# Altium schematic sheet Arduino_nano.SchDoc
size A4
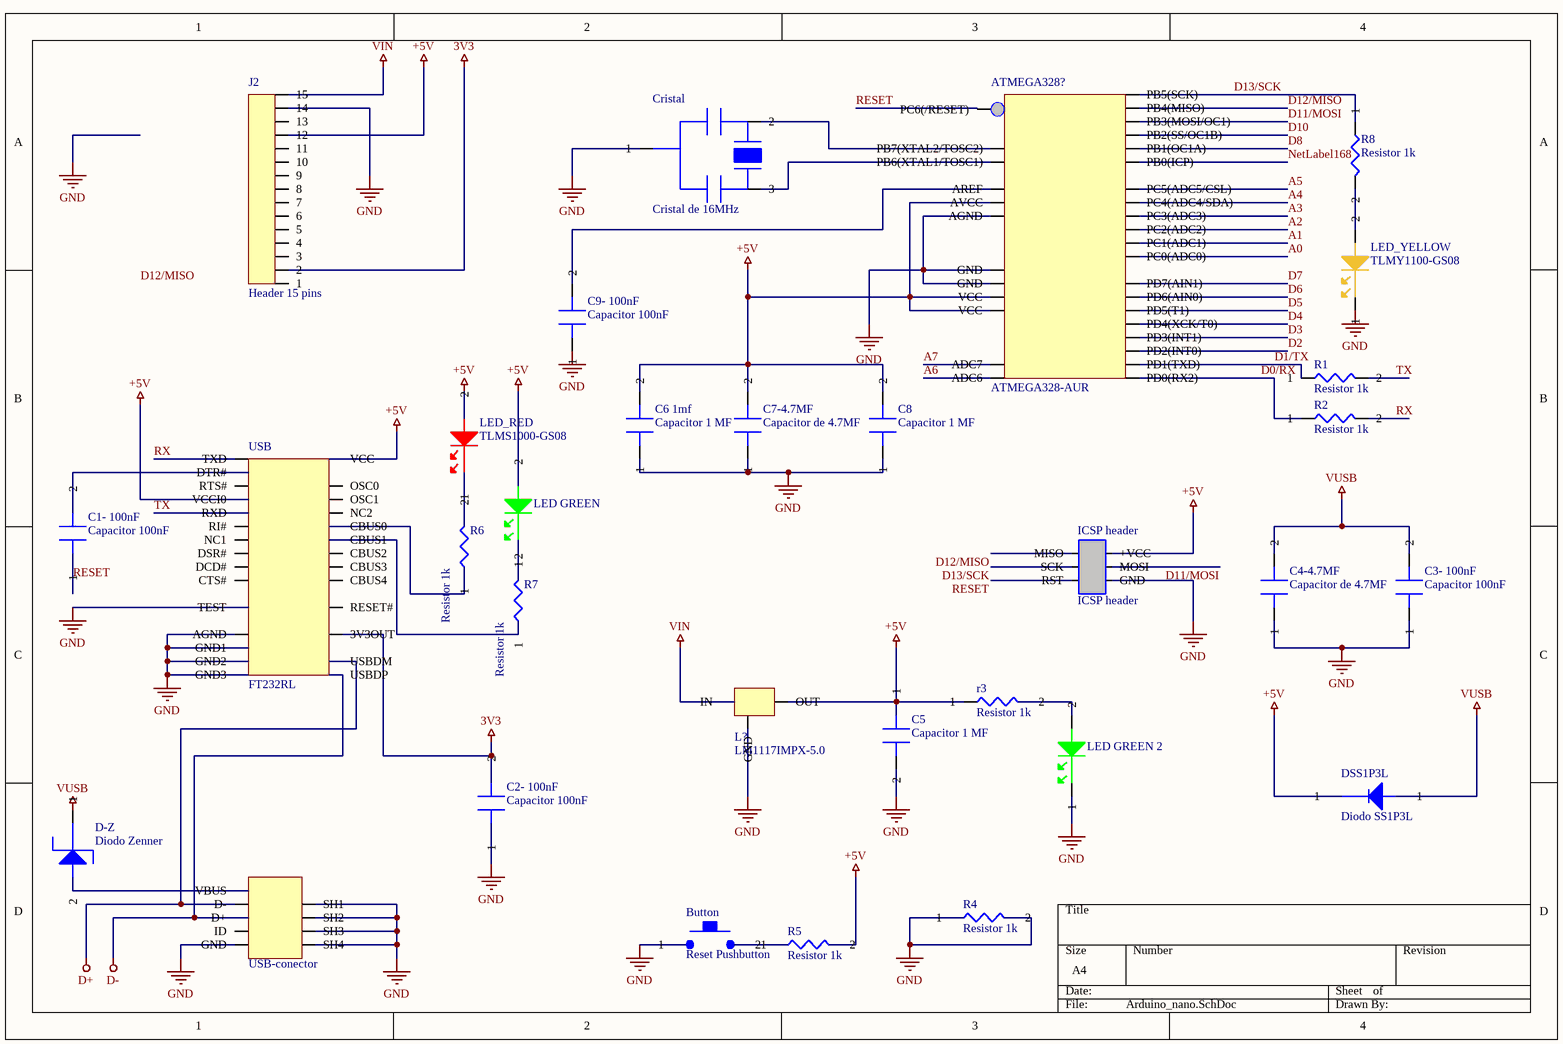
[diagram p0: Arduino_nano.SchDoc]

## Parts
(Parts that share a designator on the sheet are numbered #1, #2 ... from top to bottom, then left to right.)
ATMEGA328?  ATMEGA328-AUR
Button  Reset Pushbutton
C1-_100nF  Capacitor 100nF
C2-_100nF  Capacitor 100nF
C3-_100nF  Capacitor 100nF
C4-4.7MF  Capacitor de 4.7MF
C5  Capacitor 1 MF
C6_1mf  Capacitor 1 MF
C7-4.7MF  Capacitor de 4.7MF
C8  Capacitor 1 MF
C9-_100nF  Capacitor 100nF
Cristal  Cristal de 16MHz
D-Z  Diodo Zenner
DSS1P3L  Diodo SS1P3L
GREEN_LED?#1  LED GREEN
GREEN_LED?#2  LED GREEN 2
ICSP_header  ICSP header
J2  Header 15 pins
L?  LM1117IMPX-5.0
LED_RED  TLMS1000-GS08
LED_YELLOW  TLMY1100-GS08
R1  Resistor 1k
R2  Resistor 1k
r3  Resistor 1k
R4  Resistor 1k
R5  Resistor 1k
R6  Resistor 1k
R7  Resistor 1k
R8  Resistor 1k
USB  FT232RL
USB-conector  54819-1572  (value not drawn)

## Nets
3V3: C2-_100nF.2
+5V: C5.1 DSS1P3L.1 GREEN_LED?#1.2 LED_RED.2 R5.2 USB.38(VCCI0) USB.40(VCC)
D+: USB.36(USBDM)
D-: USB.35(USBDP) USB-conector.3(D+)
GND: Button.1 C2-_100nF.1 R4.1 R4.2 USB.37(RTS#) USB.38(GND1) USB.39(TEST)
VIN: L?.1(IN)
VUSB: DSS1P3L.1
RESET: C1-_100nF.1
TX: USB.35(TXD)
NetButton_2: Button.2 R5.1
NetC1-_100nF_2: C1-_100nF.2 USB.36(DTR#)
NetD-Z_2: D-Z.2 USB-conector.5(VBUS)
NetGREEN_LED?#1_1: GREEN_LED?#1.1 R7.2
NetGREEN_LED?#2_2: GREEN_LED?#2.2 r3.2
NetLED_RED_1: LED_RED.1 R6.2
NetR6_1: R6.1 USB.35(CBUS0)
NetR7_1: R7.1 USB.38(CBUS1)

Not connected (* = marked no-connect by the designer): ATMEGA328? 1(PC6(/RESET)) 2(PB7(XTAL2/TOSC2)) 3(PB6(XTAL1/TOSC1)) 4(AREF) 5(AVCC) 6(AGND) 7(GND) 8(GND) 9(VCC) 10(VCC) 11(ADC7) 12(ADC6) 13(PB5(SCK)) 14(PB4(MISO)) 15(PB3(MOSI/OC1)) 16(PB2(SS/OC1B)) 17(PB1(OC1A)) 18(PB0(ICP)) 19(PC5(ADC5/CSL)) 20(PC4(ADC4/SDA)) 21(PC3(ADC3)) 22(PC2(ADC2)) 23(PC1(ADC1)) 24(PC0(ADC0)) 25(PD7(AIN1)) 26(PD6(AIN0)) 27(PD5(T1)) 28(PD4(XCK/T0)) 29(PD3(INT1)) 30(PD2(INT0)) 31(PD1(TXD)) 32(PD0(RX2)); C3-_100nF 1 2; C4-4.7MF 1 2; C5 2; C6_1mf 1 2; C7-4.7MF 1 2; C8 1 2; C9-_100nF 1 2; Cristal 1 2 3; D-Z 1; GREEN_LED?#2 1; ICSP_header 1(MISO) 2(+VCC) 3(SCK) 4(MOSI) 5 (RST) 6(GND); J2 1 2 3 4 5 6 7 8 9 10 11 12 13 14 15; L? 2(GND) 3(OUT); LED_YELLOW 1 2; R1 1 2; R2 1 2; r3 1; R8 1 2; USB 41(3V3OUT); USB-conector 1(GND) 2(ID) 4(D-) 6(SH1) 7(SH2) 8(SH3) 9(SH4)

## Notes on the sheet
- Labels drawn without touching a wire or pin: D12/MISO, GND, VUSB

## Library data of the parts
ATMEGA328? = ATMEGA328-AUR: ATMEL         ATMEGA328-AUR            8 Bit Microcontroller, Low Power High Performance, ATmega, 20 MHz, 32 KB, 2 KB, 32 Pins, TQFP; Manufacturer: Microchip / Atmel; Frequency: 20MHz; Interface: I2C,SPI,UART,USART,2-Wire; Number of I/Os: 23; Oscillator Type: Internal; Memory Type: FLASH; Memory Size: 32KB; Peripherals: Brown-out Detect/Reset,POR,PWM,WDT; Core Architecture: AVR; RAM Size: 2KB; Max Supply Voltage: 5.5V; Min Supply Voltage: 1.8V; Number of Timers/Counters: 3; Data Bus Width: 8b; Watchdog Timer: Yes; Supplier 1: RSComponents; Manufacturer Part Number: ATMEGA328-AUR; RoHS: Yes; Category: Microcontrollers; Stock 1: 1; Pricing 1: 5=2,25100, 25=1,94400, 100=1,87500 (USD); Mount: Surface Mount; Case/Package: A; Number of Pins: 32; Contact Plating: Tin,Matte; Min Operating Temperature: -40°C; Max Operating Temperature: 85°C; Packaging: Tape and Reel; Series: AVR® ATmega; Package Quantity: 2000; Number of Programmable I/O: 23; Max Frequency: 20MHz; RoHS Compliant: Yes; REACH SVHC: No SVHC; ComponentLink1URL: https://datasheet.ciiva.com/46450/1693866-46450302.pdf?src-supplier=Element14; ComponentLink1Description: https://datasheet.ciiva.com/46450/1693866-46450302.pdf?src-supplier=Element14; Supplier Part Number 1: 1773199
Button = PTS526SK15SMTR2LFS: Switch Tactile N.O. SPST Round Button Gull Wing 0.05A 12VDC 200000Cycles 2.55N SMD T/R; Manufacturer: ITT C&K; Supplier 1: Digi-Key; Manufacturer Part Number: PTS526SK15SMTR2LFS; RoHS: No; Category: Tactile Switches; Stock 1: 94291; Pricing 1: 1=0,11000, 10=0,10900, 25=0,10280, 100=0,09360, 250=0,08800, 500=0,08052, 1000=0,06741 (USD); Supplier Part Number 1: CKN12221-1-ND
C1-_100nF C2-_100nF C3-_100nF C9-_100nF = CL21B104KBFXPJE: Ceramic Capacitor 0.1uF 10% X7R 50V 0805 Emboss T/R Automotive; Manufacturer: Samsung; Supplier 1: Digi-Key; Manufacturer Part Number: CL21B104KBFXPJE; RoHS: Yes; Category: Ceramic Capacitors; Stock 1: 128; Pricing 1: 1=0,24000, 10=0,16700, 50=0,11120, 100=0,09460, 500=0,06676, 1000=0,05842 (USD); RoHS Compliant: Yes; Supplier Part Number 1: 1276-CL21B104KBFXPJECT-ND
C4-4.7MF C7-4.7MF = M3253507E2A105KRMB: Manufacturer: KEMET; Supplier 1: Digi-Key; Manufacturer Part Number: M3253507E2A105KRMB; RoHS: No; Category: Ceramic Capacitors; Stock 1: 301; Pricing 1: 1=14,74000, 10=14,00300, 50=11,79200, 100=11,05500, 500=9,80210 (USD); RoHS Compliant: No; Supplier Part Number 1: 1001-2523-1-ND
C5 C6_1mf C8 = C1608X8L1C105K080AC: CAP CER 1UF 16V X8L 0603; Manufacturer: TDK; Tolerance: 10%; Supplier 1: Digi-Key; Manufacturer Part Number: C1608X8L1C105K080AC; RoHS: Yes; Category: Ceramic Capacitors; Stock 1: 20100; Pricing 1: 1=0,33000, 10=0,23000, 50=0,16100, 100=0,13800, 500=0,10350, 1000=0,08740 (USD); Mount: Surface Mount; Case/Package: 0603; Case Code (Imperial): 0603; Case Code (Metric): 1608; Min Operating Temperature: -55°C; Max Operating Temperature: 150°C; Features: High Temperature; Packaging: Tape and Reel; Capacitance: 1uF; Voltage Rating: 16V; ComponentLink1URL: https://product.tdk.com/info/en/documents/chara_sheet/C1608X8L1C105K080AC.pdf?src-supplier=Digi-Key; ComponentLink1Description: https://product.tdk.com/info/en/documents/chara_sheet/C1608X8L1C105K080AC.pdf?src-supplier=Digi-Key; Supplier Part Number 1: 445-175407-1-ND
Cristal = O 16,0-JO32-B-1V3-1-T1-LF: Manufacturer: Jauch; Supplier 1: Digi-Key; Manufacturer Part Number: O 16,0-JO32-B-1V3-1-T1-LF; RoHS: No; Stock 1: 147; Pricing 1: 1=0,90000, 10=0,79700, 50=0,74500, 100=0,65840 (USD); Supplier Part Number 1: 1908-O160-JO32-B-1V3-1-T1-LFCT-ND
D-Z = BZX884B5V1L-HG3-08: Diode Zener Single 5.1V 2% 300mW 2-Pin DFN1006 T/R; Manufacturer: Vishay; Supplier 1: Digi-Key; Manufacturer Part Number: BZX884B5V1L-HG3-08; Stock 1: 10000; Pricing 1: 1=0,38000, 10=0,31500, 100=0,16680, 500=0,10972, 1000=0,07461, 2000=0,06730, 5000=0,05852 (USD); Supplier Part Number 1: 112-BZX884B5V1L-HG3-08CT-ND
DSS1P3L = SS1P3L-M3/84A: Diode Schottky 30V 1.5A 2-Pin SMP T/R; Manufacturer: Vishay Semiconductors; Max Surge Current: 50A; Forward Voltage: 480mV; Max Reverse Current: 200uA; Element Configuration: Single; Current: 1A; Supplier 1: Digi-Key; Manufacturer Part Number: SS1P3L-M3/84A; RoHS: Yes; Category: Rectifier Diodes; Stock 1: 5665; Pricing 1: 1=0,48000, 10=0,39200, 100=0,26720, 500=0,20038, 1000=0,15028 (USD); Mount: Surface Mount; Case/Package: DO-220AA; Number of Pins: 2; Contact Plating: Tin,Matte; Min Operating Temperature: -55°C; Max Operating Temperature: 150°C; Packaging: Tape and Reel; Forward Current: 1.5A; Package Quantity: 1; Average Rectified Current: 1.5A; Peak Non-Repetitive Surge Current: 50A; Max Repetitive Reverse Voltage (Vrrm): 30V; Max Forward Surge Current (Ifsm): 50A; Voltage: 30V; Max Reverse Voltage (DC): 30V; Series: eSMP®; Length: 3.61mm; Width: 2.18mm; Height: 1.15mm; Radiation Hardening: No; Lead Free: Lead Free; RoHS Compliant: Yes; ComponentLink1URL: https://datasheet.ciiva.com/16217/ss1p3l-16217789.pdf?src-supplier=Future+Electronics; ComponentLink1Description: https://datasheet.ciiva.com/16217/ss1p3l-16217789.pdf?src-supplier=Future+Electronics; ComponentLink2URL: https://datasheet.ciiva.com/25932/ss1p3l-25932252.pdf?src-supplier=Avnet+Europe; ComponentLink2Description: https://datasheet.ciiva.com/25932/ss1p3l-25932252.pdf?src-supplier=Avnet+Europe; Supplier Part Number 1: SS1P3L-M3/84AGICT-ND
GREEN_LED?#1 GREEN_LED?#2 = TLMG1100-GS08: Standard LEDs - SMD Green Non-Diffused; Manufacturer: Vishay Semiconductors; Viewing Angle: 160°; Lens Style: Rectangular,Diffused; Luminous Intensity: 35mcd; Forward Current: 20mA; Forward Voltage: 2.1V; Wavelength: 570nm; Power Rating: 90mW; Number of Elements: 1; Voltage Rating (DC): 3V; Reverse Voltage: 6V; Supplier 1: Digi-Key; Manufacturer Part Number: TLMG1100-GS08; RoHS: Yes; Category: LEDs; Stock 1: 166547; Pricing 1: 1=0,42000, 10=0,34400, 100=0,23400, 500=0,17554, 1000=0,13165 (USD); Mount: Surface Mount,PCB; Case/Package: 0603; Number of Pins: 2; Color: Green; Case Code (Metric): 1608; Case Code (Imperial): 0603; Contact Plating: Gold; Min Operating Temperature: -40°C; Max Operating Temperature: 100°C; Packaging: Tape and Reel; Package Quantity: 1; Illumination Color: Green; Dominant Wavelength: 570nm; Test Current: 20mA; Power Dissipation: 90mW; Max Power Dissipation: 90mW; Number of LEDs: 1; Series: -; Length: 1.6mm; Width: 0.8mm; Height: 0.65mm; Depth: 0.8mm; Radiation Hardening: No; REACH SVHC: Unknown; Lead Free: Lead Free; RoHS Compliant: Yes; ComponentLink1URL: https://datasheet.ciiva.com/11773/0900766b80ed1fab-11773829.pdf?src-supplier=RSComponents; ComponentLink1Description: https://datasheet.ciiva.com/11773/0900766b80ed1fab-11773829.pdf?src-supplier=RSComponents; ComponentLink2URL: https://datasheet.ciiva.com/15118/getdatasheetpartid-196748-15118054.pdf?src-supplier=Verical; ComponentLink2Description: https://datasheet.ciiva.com/15118/getdatasheetpartid-196748-15118054.pdf?src-supplier=Verical; ComponentLink3URL: https://datasheet.ciiva.com/2109/tlmb1100-2109919.pdf?src-supplier=Digi-Key; ComponentLink3Description: https://datasheet.ciiva.com/2109/tlmb1100-2109919.pdf?src-supplier=Digi-Key; ComponentLink4URL: https://datasheet.ciiva.com/2109/tlmb1100-2109920.pdf?src-supplier=Digi-Key; ComponentLink4Description: https://datasheet.ciiva.com/2109/tlmb1100-2109920.pdf?src-supplier=Digi-Key; ComponentLink5URL: https://datasheet.ciiva.com/2109/tlmb1100-2109921.pdf?src-supplier=Digi-Key; ComponentLink5Description: https://datasheet.ciiva.com/2109/tlmb1100-2109921.pdf?src-supplier=Digi-Key; ComponentLink6URL: https://datasheet.ciiva.com/3166/tlmb1100-3166505.pdf?src-supplier=Avnet; ComponentLink6Description: https://datasheet.ciiva.com/3166/tlmb1100-3166505.pdf?src-supplier=Avnet; ComponentLink7URL: https://datasheet.ciiva.com/3166/tlmb1100-3166935.pdf?src-supplier=Avnet; ComponentLink7Description: https://datasheet.ciiva.com/3166/tlmb1100-3166935.pdf?src-supplier=Avnet; ComponentLink8URL: https://datasheet.ciiva.com/5798/tlmb1100-5798250.pdf?src-supplier=Farnell; ComponentLink8Description: https://datasheet.ciiva.com/5798/tlmb1100-5798250.pdf?src-supplier=Farnell; ComponentLink9URL: https://datasheet.ciiva.com/5798/485053-5798326.pdf?src-supplier=Farnell; ComponentLink9Description: https://datasheet.ciiva.com/5798/485053-5798326.pdf?src-supplier=Farnell; ComponentLink10URL: https://datasheet.ciiva.com/16299/tlmb1100-16299239.pdf?src-supplier=Future+Electronics; ComponentLink10Description: https://datasheet.ciiva.com/16299/tlmb1100-16299239.pdf?src-supplier=Future+Electronics; ComponentLink11URL: https://datasheet.ciiva.com/22655/1911389-22655622.pdf?src-supplier=Element14; ComponentLink11Description: https://datasheet.ciiva.com/22655/1911389-22655622.pdf?src-supplier=Element14; ComponentLink12URL: https://datasheet.ciiva.com/22655/1911389-22655641.pdf?src-supplier=Element14; ComponentLink12Description: https://datasheet.ciiva.com/22655/1911389-22655641.pdf?src-supplier=Element14; ComponentLink13URL: https://datasheet.ciiva.com/8027/485053-8027918.pdf?src-supplier=Element14; ComponentLink13Description: https://datasheet.ciiva.com/8027/485053-8027918.pdf?src-supplier=Element14; Supplier Part Number 1: 751-1165-1-ND
ICSP_header = MIKROE-4283: Manufacturer: mikroElektronika; Supplier 1: Digi-Key; Manufacturer Part Number: MIKROE-4283; RoHS: No; Stock 1: 4; Pricing 1: 1=4,00000 (USD); Supplier Part Number 1: 1471-MIKROE-4283-ND
J2 = 61301511121: WURTH ELEKTRONIK - 61301511121 - Connecteur carte-à-carte, Vertical, 2.54 mm, 15 Contact(s), Embase, Série WR-PHD, Traversant; Manufacturer: Wurth Electronics; Number of Positions: 15; Gender: Male; Connector Type: Male Pin; Pitch: 0.1inch; Supplier 1: Digi-Key; Manufacturer Part Number: 61301511121; RoHS: Yes; Category: Headers and Wire Housings; Stock 1: 1127; Pricing 1: 1=0,82000, 10=0,69700, 25=0,58120, 50=0,48400, 100=0,44000, 500=0,40000 (USD); Mount: Through Hole; Contact Plating: Gold; Contact Material: Copper; Color: Black; Number of Rows: 1; Packaging: Bulk; Termination: Solder; Number of Contacts: 15; Contact Mating Length: 0.236inch; REACH SVHC: Unknown; RoHS Compliant: Yes; ComponentLink1URL: http://www.farnell.com/cad/1737268.pdf?src-supplier=Element14; ComponentLink1Description: http://www.farnell.com/cad/1737268.pdf?src-supplier=Element14; ComponentLink2URL: https://katalog.we-online.de/em/datasheet/6130xx11121.pdf?src-supplier=Digi-Key; ComponentLink2Description: https://katalog.we-online.de/em/datasheet/6130xx11121.pdf?src-supplier=Digi-Key; Supplier Part Number 1: 732-5326-ND
L? = LM1117IMPX-5.0: IC REG LINEAR 5V 800MA SOT223-4; Manufacturer: Texas Instruments; Dropout Voltage: 1.2V; Number of Outputs: 1; Max Input Voltage: 15V; Polarity: Positive; Quiescent Current: 15mA; Accuracy: 1%; Output Type: Fixed; Supplier 1: Newark; Manufacturer Part Number: LM1117IMPX-5.0; RoHS: No; Category: Voltage Regulators - Linear; Mount: Surface Mount; Case/Package: SOT-223; Number of Pins: 4; Min Operating Temperature: -40°C; Max Operating Temperature: 125°C; Package Quantity: 2000; Packaging: Tape and Reel; Max Output Current: 800mA; Output Voltage: 5V; Output Current: 800mA; Number of Regulators: 1; Min Current Limit: 800mA; Output Voltage Accuracy: 1%; Radiation Hardening: No; Lead Free: Contains Lead; ComponentLink1URL: https://datasheet.ciiva.com/14275/lm1117-n-14275238.pdf?src-supplier=Avnet; ComponentLink1Description: https://datasheet.ciiva.com/14275/lm1117-n-14275238.pdf?src-supplier=Avnet; Supplier Part Number 1: 74C3927
LED_RED = TLMS1000-GS08: LED RED 0603 SMD; Manufacturer: Vishay; Forward Voltage: 1.8V; Luminous Intensity: 4mcd; Wavelength: 636nm; Viewing Angle: 160°; Forward Current: 2mA; Power Rating: 40mW; Lens Style: Rectangular; Dominant Wavelength: 628nm; Number of Elements: 1; Reverse Voltage: 12V; Supplier 1: Digi-Key; Manufacturer Part Number: TLMS1000-GS08; RoHS: Yes; Category: LEDs; Stock 1: 60794; Pricing 1: 1=0,42000, 10=0,34400, 100=0,23410, 500=0,17562, 1000=0,13171 (USD); Mount: Surface Mount; Case/Package: 0603; Number of Pins: 2; Color: Red; Case Code (Metric): 1608; Case Code (Imperial): 0603; Min Operating Temperature: -40°C; Max Operating Temperature: 100°C; Packaging: Tape and Reel; Package Quantity: 3000; Illumination Color: Red; Test Current: 2mA; Max Power Dissipation: 40mW; Power Dissipation: 40mW; Number of LEDs: 1; Series: -; Length: 1.6mm; Width: 0.8mm; Height: 0.6mm; Depth: 0.8mm; Radiation Hardening: No; REACH SVHC: Unknown; Lead Free: Lead Free; RoHS Compliant: Yes; ComponentLink1URL: https://datasheet.ciiva.com/4267/tlmo1000-4267955.pdf?src-supplier=Arrow+Electronics; ComponentLink1Description: https://datasheet.ciiva.com/4267/tlmo1000-4267955.pdf?src-supplier=Arrow+Electronics; ComponentLink2URL: https://datasheet.ciiva.com/5798/1698881-5798337.pdf?src-supplier=Farnell; ComponentLink2Description: https://datasheet.ciiva.com/5798/1698881-5798337.pdf?src-supplier=Farnell; ComponentLink3URL: https://datasheet.ciiva.com/15117/getdatasheetpartid-107692-15117475.pdf?src-supplier=Verical; ComponentLink3Description: https://datasheet.ciiva.com/15117/getdatasheetpartid-107692-15117475.pdf?src-supplier=Verical; ComponentLink4URL: https://datasheet.ciiva.com/26215/tlmo1000-26215312.pdf?src-supplier=Avnet+Europe; ComponentLink4Description: https://datasheet.ciiva.com/26215/tlmo1000-26215312.pdf?src-supplier=Avnet+Europe; ComponentLink5URL: https://datasheet.ciiva.com/8027/485055-8027936.pdf?src-supplier=Element14; ComponentLink5Description: https://datasheet.ciiva.com/8027/485055-8027936.pdf?src-supplier=Element14; ComponentLink6URL: https://datasheet.ciiva.com/9323/tlmo1000-9323993.pdf?src-supplier=Avnet; ComponentLink6Description: https://datasheet.ciiva.com/9323/tlmo1000-9323993.pdf?src-supplier=Avnet; ComponentLink7URL: https://datasheet.ciiva.com/18614/tlmo1000-18614329.pdf?src-supplier=Digi-Key; ComponentLink7Description: https://datasheet.ciiva.com/18614/tlmo1000-18614329.pdf?src-supplier=Digi-Key; ComponentLink8URL: https://datasheet.ciiva.com/29562/tlmo1000-29562780.pdf?src-supplier=Digi-Key; ComponentLink8Description: https://datasheet.ciiva.com/29562/tlmo1000-29562780.pdf?src-supplier=Digi-Key; ComponentLink9URL: https://datasheet.ciiva.com/29562/tlmo1000-29562781.pdf?src-supplier=Digi-Key; ComponentLink9Description: https://datasheet.ciiva.com/29562/tlmo1000-29562781.pdf?src-supplier=Digi-Key; ComponentLink10URL: https://datasheet.ciiva.com/29562/tlmo1000-29562782.pdf?src-supplier=Digi-Key; ComponentLink10Description: https://datasheet.ciiva.com/29562/tlmo1000-29562782.pdf?src-supplier=Digi-Key; ComponentLink11URL: https://datasheet.ciiva.com/16379/tlmo1000-16379643.pdf?src-supplier=Future+Electronics; ComponentLink11Description: https://datasheet.ciiva.com/16379/tlmo1000-16379643.pdf?src-supplier=Future+Electronics; ComponentLink12URL: https://datasheet.ciiva.com/8027/1698881-8027932.pdf?src-supplier=Element14; ComponentLink12Description: https://datasheet.ciiva.com/8027/1698881-8027932.pdf?src-supplier=Element14; ComponentLink13URL: https://datasheet.ciiva.com/8027/1698881-8027934.pdf?src-supplier=Element14; ComponentLink13Description: https://datasheet.ciiva.com/8027/1698881-8027934.pdf?src-supplier=Element14; ComponentLink14URL: https://datasheet.ciiva.com/22655/1698881-22655643.pdf?src-supplier=Element14; ComponentLink14Description: https://datasheet.ciiva.com/22655/1698881-22655643.pdf?src-supplier=Element14; Supplier Part Number 1: TLMS1000-GS08CT-ND
LED_YELLOW = TLMY1100-GS08: VISHAY - TLMY1100-GS08 - LED, Yellow, SMD, 0603, 20 mA, 2.1 V, 587 nm; Manufacturer: Vishay Semiconductors; Wavelength: 595nm; Luminous Intensity: 80mcd; Viewing Angle: 160°; Forward Voltage: 2.1V; Forward Current: 20mA; Lens Style: Rectangular,Diffused; Power Rating: 90mW; Dominant Wavelength: 587nm; Number of Elements: 1; Voltage Rating (DC): 3V; Reverse Voltage: 6V; Supplier 1: Digi-Key; Manufacturer Part Number: TLMY1100-GS08; RoHS: Yes; Category: LEDs; Stock 1: 1729; Pricing 1: 1=0,42000, 10=0,34400, 100=0,23440, 500=0,17580, 1000=0,13184 (USD); Mount: Surface Mount; Case/Package: 0603; Number of Pins: 2; Color: Yellow; Case Code (Metric): 1608; Case Code (Imperial): 0603; Contact Plating: Gold; Min Operating Temperature: -40°C; Max Operating Temperature: 100°C; Packaging: Tape and Reel; Illumination Color: Yellow; Package Quantity: 3000; Test Current: 20mA; Power Dissipation: 90mW; Number of LEDs: 1; Max Power Dissipation: 90mW; Series: -; Length: 1.6mm; Width: 0.8mm; Height: 0.65mm; Depth: 0.8mm; Radiation Hardening: No; REACH SVHC: Unknown; Lead Free: Lead Free; RoHS Compliant: Yes; ComponentLink1URL: https://datasheet.ciiva.com/4266/tlmb1100-4266598.pdf?src-supplier=Arrow+Electronics; ComponentLink1Description: https://datasheet.ciiva.com/4266/tlmb1100-4266598.pdf?src-supplier=Arrow+Electronics; ComponentLink2URL: https://datasheet.ciiva.com/26928/getdatasheetpartid-246085-26928483.pdf?src-supplier=Verical; ComponentLink2Description: https://datasheet.ciiva.com/26928/getdatasheetpartid-246085-26928483.pdf?src-supplier=Verical; ComponentLink3URL: https://datasheet.ciiva.com/2109/tlmb1100-2109916.pdf?src-supplier=Digi-Key; ComponentLink3Description: https://datasheet.ciiva.com/2109/tlmb1100-2109916.pdf?src-supplier=Digi-Key; ComponentLink4URL: https://datasheet.ciiva.com/2109/tlmb1100-2109917.pdf?src-supplier=Digi-Key; ComponentLink4Description: https://datasheet.ciiva.com/2109/tlmb1100-2109917.pdf?src-supplier=Digi-Key; ComponentLink5URL: https://datasheet.ciiva.com/2109/tlmb1100-2109918.pdf?src-supplier=Digi-Key; ComponentLink5Description: https://datasheet.ciiva.com/2109/tlmb1100-2109918.pdf?src-supplier=Digi-Key; ComponentLink6URL: https://datasheet.ciiva.com/3166/tlmb1100-3166936.pdf?src-supplier=Avnet; ComponentLink6Description: https://datasheet.ciiva.com/3166/tlmb1100-3166936.pdf?src-supplier=Avnet; ComponentLink7URL: https://datasheet.ciiva.com/26322/tlmb1100-26322126.pdf?src-supplier=Element14; ComponentLink7Description: https://datasheet.ciiva.com/26322/tlmb1100-26322126.pdf?src-supplier=Element14; ComponentLink8URL: https://datasheet.ciiva.com/16501/tlmb1100-16501335.pdf?src-supplier=Future+Electronics; ComponentLink8Description: https://datasheet.ciiva.com/16501/tlmb1100-16501335.pdf?src-supplier=Future+Electronics; ComponentLink9URL: https://datasheet.ciiva.com/26156/tlmb1100-26156618.pdf?src-supplier=Avnet+Europe; ComponentLink9Description: https://datasheet.ciiva.com/26156/tlmb1100-26156618.pdf?src-supplier=Avnet+Europe; ComponentLink10URL: https://datasheet.ciiva.com/14657/tlmb1100-14657975.pdf?src-supplier=Element14; ComponentLink10Description: https://datasheet.ciiva.com/14657/tlmb1100-14657975.pdf?src-supplier=Element14; Supplier Part Number 1: 751-1186-1-ND
R1 R2 r3 R4-R8 = Y40621K00000Q0R: RES SMD 1K OHM 0.02% 0.3W 0805; Manufacturer: VPG Foil Resistors; Resistance: 1kR; Max Power Dissipation: 300mW; Temperature Coefficient: 2.5ppm/°C; Supplier 1: Digi-Key; Manufacturer Part Number: Y40621K00000Q0R; RoHS: Yes; Category: Chip SMD Resistors; Stock 1: 125; Pricing 1: 1=19,65000, 10=17,16400, 25=15,51000 (USD); Case/Package: 0805; Case Code (Metric): 2012; Case Code (Imperial): 0805; Min Operating Temperature: -55°C; Max Operating Temperature: 200°C; Package Quantity: 1; Tolerance: 0.02%; Packaging: Tape and Reel; Resistor Type: Metal Foil; Number of Terminations: 2; Features: Moisture Resistant; Series: FRSH; Length: 0.08inch; Width: 0.05inch; Height: 0.025inch; RoHS Compliant: Yes; ComponentLink1URL: https://datasheet.ciiva.com/2629/frsh-z-2629516.pdf?src-supplier=Digi-Key; ComponentLink1Description: https://datasheet.ciiva.com/2629/frsh-z-2629516.pdf?src-supplier=Digi-Key; ComponentLink2URL: https://datasheet.ciiva.com/2629/frsh-z-2629517.pdf?src-supplier=Digi-Key; ComponentLink2Description: https://datasheet.ciiva.com/2629/frsh-z-2629517.pdf?src-supplier=Digi-Key; ComponentLink3URL: https://datasheet.ciiva.com/2629/frsh-z-2629518.pdf?src-supplier=Digi-Key; ComponentLink3Description: https://datasheet.ciiva.com/2629/frsh-z-2629518.pdf?src-supplier=Digi-Key; Supplier Part Number 1: Y4062-1.0KACT-ND
USB = FT232RL-REEL: FTDI - FT232RL-REEL - Interface Bridges, USB to UART, 1.8 V, 5.25 V, SSOP, 28 Pins, -40 °C; Interface: UART,RS-232,RS-422,RS-485; Number of Channels: 1; Max Supply Voltage: 5.25V; Min Supply Voltage: 3.3V; Data Rate: 12Mbps; Operating Supply Current: 15mA; Voltage: 5V; Supplier 1: Newark; Manufacturer: FTDI; Manufacturer Part Number: FT232RL-REEL; RoHS: Yes; Category: Interface ICs; Pricing 1: 1=5,36000, 10=4,83000, 50=4,58000, 100=4,35000, 250=3,88000, 500=3,39000, 1000=3,16000, 2000=3,10000 (USD); Mount: Surface Mount; Case/Package: SSOP; Number of Pins: 28; Weight: 0.080001oz; Min Operating Temperature: -40°C; Max Operating Temperature: 85°C; Packaging: Tape and Reel; Package Quantity: 2000; Series: USBmadeEZ-UART; Number of Transceivers: 1; Length: 10.2mm; Width: 5.3mm; Height: 1.75mm; Radiation Hardening: No; REACH SVHC: No SVHC; Lead Free: Lead Free; RoHS Compliant: Yes; ComponentLink1URL: https://datasheet.ciiva.com/4787/ds-ft232r-11534-4787658.pdf?src-supplier=Mouser; ComponentLink1Description: https://datasheet.ciiva.com/4787/ds-ft232r-11534-4787658.pdf?src-supplier=Mouser; ComponentLink2URL: https://datasheet.ciiva.com/34304/2161019-34304054.pdf?src-supplier=Jameco; ComponentLink2Description: https://datasheet.ciiva.com/34304/2161019-34304054.pdf?src-supplier=Jameco; ComponentLink3URL: https://datasheet.ciiva.com/26841/ft232rl-reel-26841080.pdf?src-supplier=IIIC; ComponentLink3Description: https://datasheet.ciiva.com/26841/ft232rl-reel-26841080.pdf?src-supplier=IIIC; ComponentLink4URL: https://datasheet.ciiva.com/1787/ds-ft232r-1787047.pdf?src-supplier=Digi-Key; ComponentLink4Description: https://datasheet.ciiva.com/1787/ds-ft232r-1787047.pdf?src-supplier=Digi-Key; ComponentLink5URL: https://datasheet.ciiva.com/1787/ds-ft232r-1787048.pdf?src-supplier=Digi-Key; ComponentLink5Description: https://datasheet.ciiva.com/1787/ds-ft232r-1787048.pdf?src-supplier=Digi-Key; ComponentLink6URL: https://datasheet.ciiva.com/1787/ds-ft232r-1787049.pdf?src-supplier=Digi-Key; ComponentLink6Description: https://datasheet.ciiva.com/1787/ds-ft232r-1787049.pdf?src-supplier=Digi-Key; ComponentLink7URL: https://datasheet.ciiva.com/15150/getdatasheetpartid-643207-15150506.pdf?src-supplier=Verical; ComponentLink7Description: https://datasheet.ciiva.com/15150/getdatasheetpartid-643207-15150506.pdf?src-supplier=Verical; ComponentLink8URL: https://datasheet.ciiva.com/16200/ds-ft232r-16200652.pdf?src-supplier=Future+Electronics; ComponentLink8Description: https://datasheet.ciiva.com/16200/ds-ft232r-16200652.pdf?src-supplier=Future+Electronics; Supplier Part Number 1: 91K9918
USB-conector = 54819-1572: Conn Mini USB 2.0 Type B RCP 5 POS 0.8mm Solder RA SMD 5 Terminal 1 Port T/R; Manufacturer: Molex; Number of Terminals/Pins: 5; Gender: Female; Connector Type: USB,Receptacle; Number of Ports: 1; Voltage Rating: 30V; Current Rating: 1A; Supplier 1: Digi-Key; Manufacturer Part Number: 54819-1572; RoHS: Yes; Category: Connectors; Stock 1: 4531; Pricing 1: 1=2,28000, 10=1,94400, 100=1,60590 (USD); Mount: Surface Mount; Contact Plating: Gold,Tin; Contact Material: Copper Alloy,Copper; Housing Material: Polyphthalamide; Min Operating Temperature: 0°C; Max Operating Temperature: 50°C; Packaging: Tape and Reel; Package Quantity: 800; Number of Contacts: 5; Termination: SMD/SMT; Orientation: Right Angle; Series: 54819; Number of Positions: 5; Number of Circuits: 5; Length: 9.9mm; Pitch: 0.8mm; RoHS Compliant: Yes; REACH SVHC: Unknown; Halogen Free: Low Halogen; ComponentLink1URL: https://datasheet.ciiva.com/4562/0548191572-io-connectors-143940-4562349.pdf?src-supplier=Mouser; ComponentLink1Description: https://datasheet.ciiva.com/4562/0548191572-io-connectors-143940-4562349.pdf?src-supplier=Mouser; ComponentLink2URL: https://datasheet.ciiva.com/16143/0548191572-io-nectors-16143238.pdf?src-supplier=Onlinecomponents.com; ComponentLink2Description: https://datasheet.ciiva.com/16143/0548191572-io-nectors-16143238.pdf?src-supplier=Onlinecomponents.com; ComponentLink3URL: https://datasheet.ciiva.com/30061/0548191572-io-connectors-30061113.pdf?src-supplier=Onlinecomponents.com; ComponentLink3Description: https://datasheet.ciiva.com/30061/0548191572-io-connectors-30061113.pdf?src-supplier=Onlinecomponents.com; ComponentLink4URL: https://datasheet.ciiva.com/1098/65947-1098708.pdf?src-supplier=Element14; ComponentLink4Description: https://datasheet.ciiva.com/1098/65947-1098708.pdf?src-supplier=Element14; Supplier Part Number 1: WM6794CT-ND